# EAGLE design PT4115 Breakout (EAGLE 6.2)
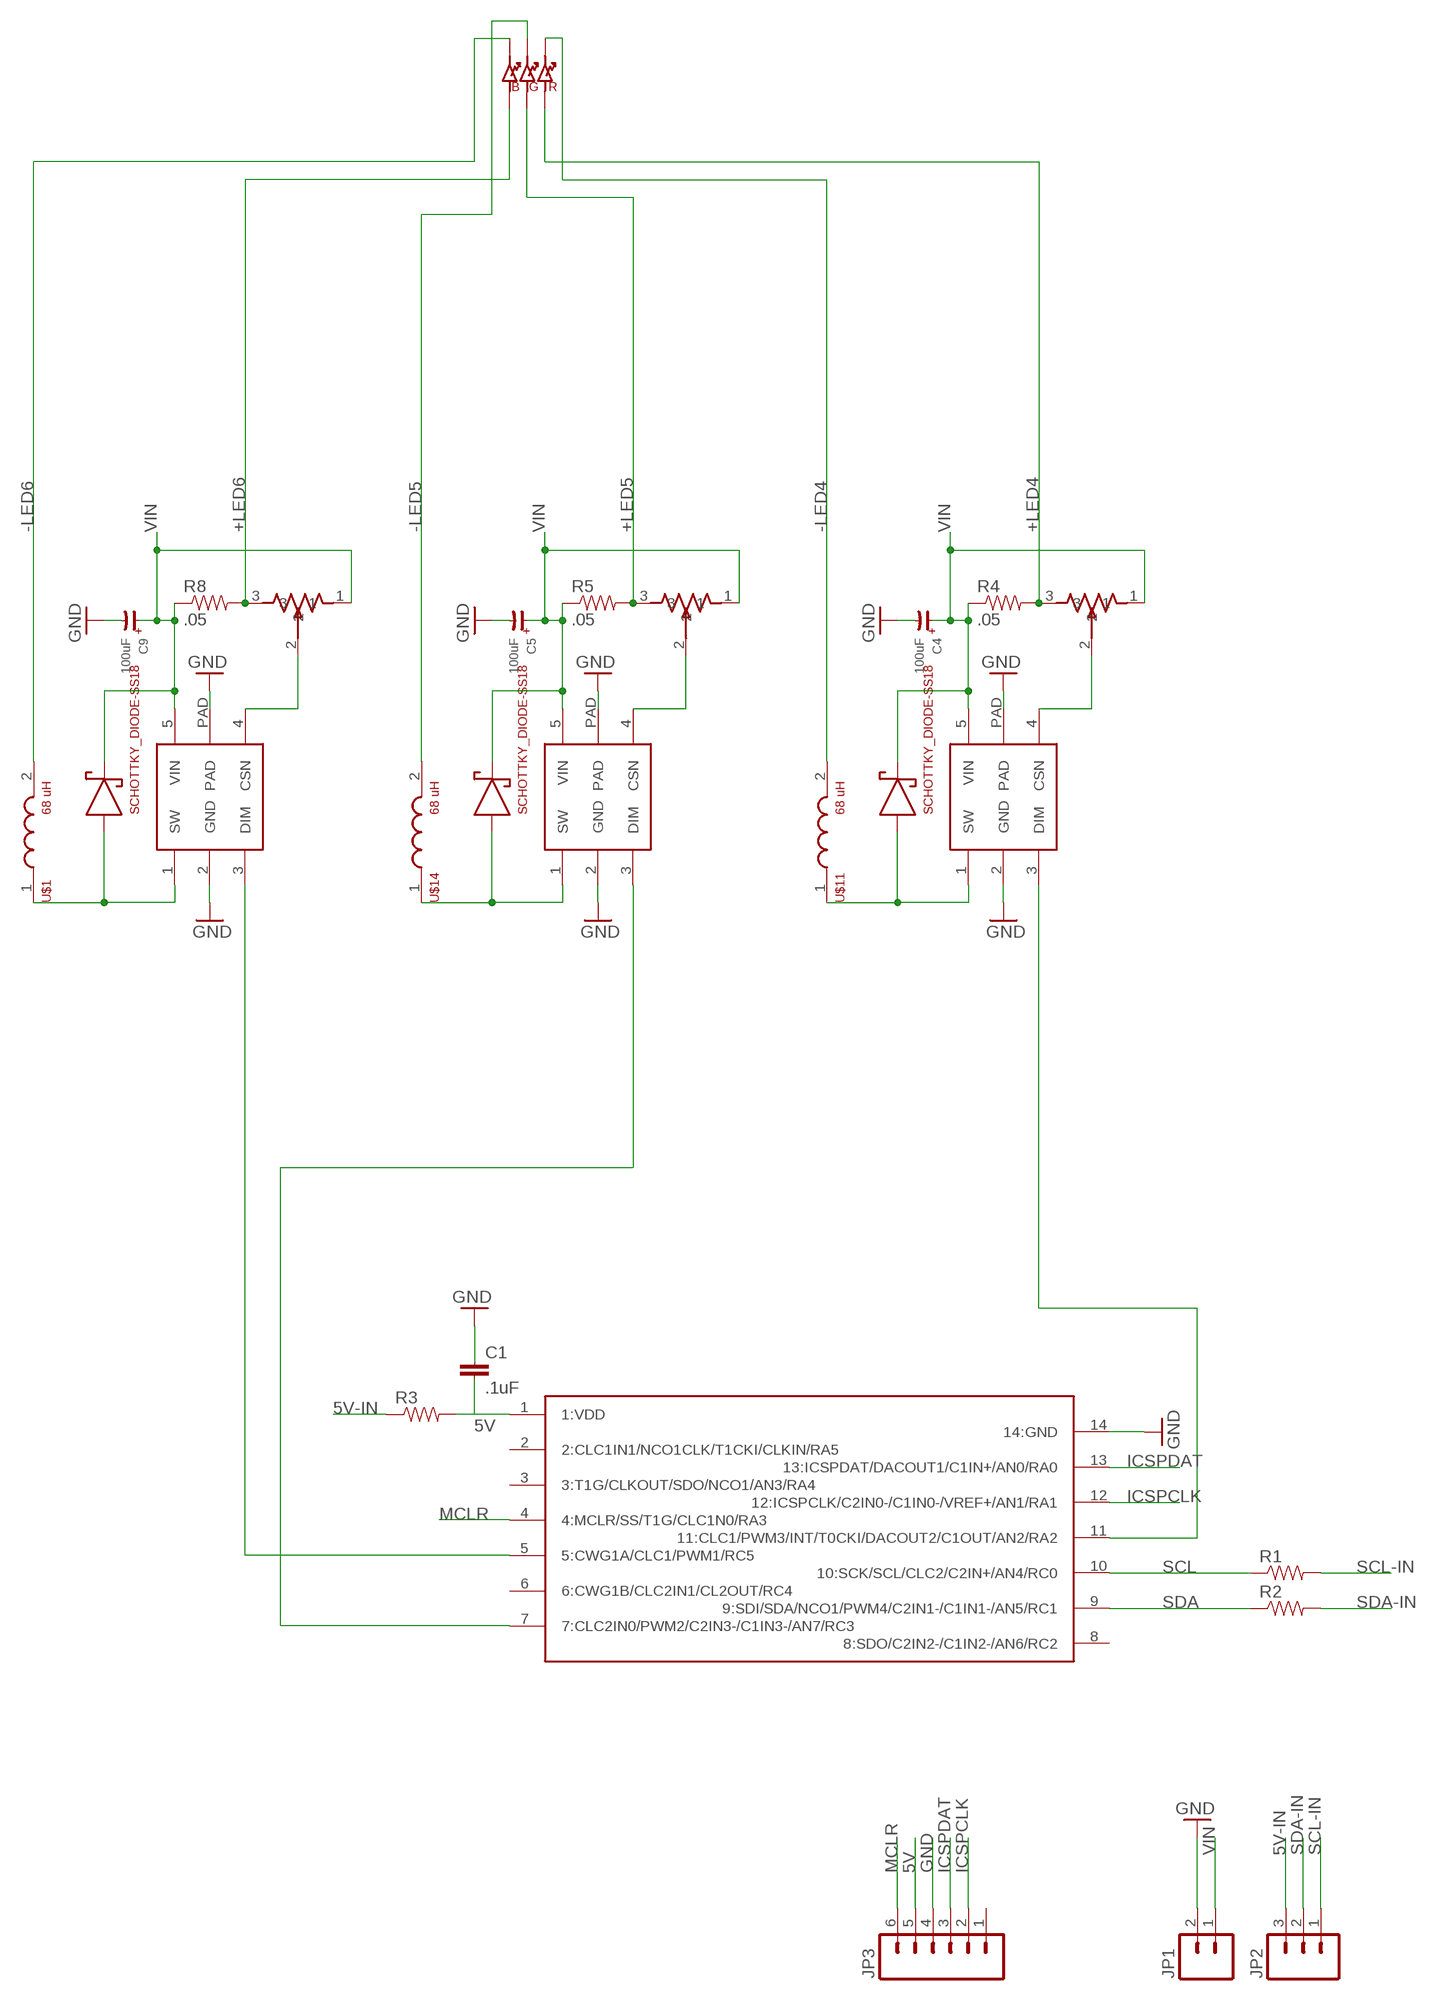
[diagram p0: schematic, sheet 1]

## Parts
C1  .1uF  CAP0805  [0805]
C4  100uF  CAPPOL-8X11  [8MMCAP]
C5  100uF  CAPPOL-8X11  [8MMCAP]
C9  100uF  CAPPOL-8X11  [8MMCAP]
JP1  M02LOCK  [1X02_LOCK]
JP2  M03LOCK  [1X03_LOCK]
JP3  M06LOCK  [1X06_LOCK]
R1  RESISTOR  [0805]
R2  RESISTOR  [0805]
R3  RESISTOR  [0805]
R4  .05  RESISTOR1206  [1206]
R5  .05  RESISTOR1206  [1206]
R8  .05  RESISTOR1206  [1206]
U$1  68 uH  INDUCTORVLF10040  [VLF10040]
U$4  BIGRGB  [BIGRGB]
U$5  PIC16F1503TSSOP14  [TSSOP14]
U$8  TRIMPOTTC33X-2  [TC33X-2]
U$9  TRIMPOTTC33X-2  [TC33X-2]
U$10  TRIMPOTTC33X-2  [TC33X-2]
U$11  68 uH  INDUCTORVLF10040  [VLF10040]
U$12  SCHOTTKY_DIODE-SS18  [DO-214]
U$13  PT4115  [SOT89-5]
U$14  68 uH  INDUCTORVLF10040  [VLF10040]
U$15  SCHOTTKY_DIODE-SS18  [DO-214]
U$16  PT4115  [SOT89-5]
U$23  SCHOTTKY_DIODE-SS18  [DO-214]
U$24  PT4115  [SOT89-5]

## Nets
5V: C1.2 JP3.5 R3.2 U$5.1(1:VDD)
5V-IN: JP2.3 R3.1
+LED4: R4.2 U$4.R+ U$10.3
+LED5: R5.2 U$4.G+ U$9.3
+LED6: R8.2 U$4.B+ U$8.3
-LED4: U$4.R- U$11.2
-LED5: U$4.G- U$14.2
-LED6: U$1.2 U$4.B-
GND: C1.1 C4.- C5.- C9.- JP1.2 JP3.4 U$5.14(14:GND) U$13.2(GND) U$13.PAD U$16.2(GND) U$16.PAD U$24.2(GND) U$24.PAD
ICSPCLK: JP3.2 U$5.12(12:ICSPCLK/C2IN0-/C1IN0-/VREF+/AN1/RA1)
ICSPDAT: JP3.3 U$5.13(13:ICSPDAT/DACOUT1/C1IN+/AN0/RA0)
MCLR: JP3.6 U$5.4(4:MCLR/SS/T1G/CLC1N0/RA3)
N$1: U$5.5(5:CWG1A/CLC1/PWM1/RC5) U$24.3(DIM)
N$2: U$5.7(7:CLC2IN0/PWM2/C2IN3-/C1IN3-/AN7/RC3) U$16.3(DIM)
N$3: U$5.11(11:CLC1/PWM3/INT/T0CKI/DACOUT2/C1OUT/AN2/RA2) U$13.3(DIM)
N$4: U$8.2 U$24.4(CSN)
N$5: U$9.2 U$16.4(CSN)
N$6: U$10.2 U$13.4(CSN)
SCL: R1.1 U$5.10(10:SCK/SCL/CLC2/C2IN+/AN4/RC0)
SCL-IN: JP2.1 R1.2
SDA: R2.1 U$5.9(9:SDI/SDA/NCO1/PWM4/C2IN1-/C1IN1-/AN5/RC1)
SDA-IN: JP2.2 R2.2
SW4: U$11.1 U$12.P$2(ANODE) U$13.1(SW)
SW5: U$14.1 U$15.P$2(ANODE) U$16.1(SW)
SW6: U$1.1 U$23.P$2(ANODE) U$24.1(SW)
VIN: C4.+ C5.+ C9.+ JP1.1 R4.1 R5.1 R8.1 U$8.1 U$9.1 U$10.1 U$12.P$1(CATHODE) U$13.5(VIN) U$15.P$1(CATHODE) U$16.5(VIN) U$23.P$1(CATHODE) U$24.5(VIN)
Unconnected: JP3.1 U$5.2(2:CLC1IN1/NCO1CLK/T1CKI/CLKIN/RA5) U$5.3(3:T1G/CLKOUT/SDO/NCO1/AN3/RA4) U$5.6(6:CWG1B/CLC2IN1/CL2OUT/RC4) U$5.8(8:SDO/C2IN2-/C1IN2-/AN6/RC2)

## Library data of the parts
C1 = 1dah:CAP: Capacitor Standard 0402 ceramic capacitor, and 0.1" leaded capacitor.
C4 C5 C9 = 1dah:CAPPOL
JP1 = 1dah:M02: Header 2 Standard 2-pin 0.1" header. Use with straight break away headers (SKU : PRT-00116), right angle break away headers (PRT-00553), swiss pins (PRT-00743), machine pins (PRT-00117), and female headers (PRT-00115). Molex polarized connector foot print use with SKU : PRT-08233 with associated crimp pins and housings.
JP2 = 1dah:M03: Header 3 Standard 3-pin 0.1" header. Use with straight break away headers (SKU : PRT-00116), right angle break away headers (PRT-00553), swiss pins (PRT-00743), machine pins (PRT-00117), and female headers (PRT-00115). Molex polarized connector foot print use with SKU : PRT-08232 with associated crimp pins and housings.
JP3 = 1dah:M06: Header 6 Standard 6-pin 0.1" header. Use with straight break away headers (SKU : PRT-00116), right angle break away headers (PRT-00553), swiss pins (PRT-00743), machine pins (PRT-00117), and female headers (PRT-00115). Molex polarized connector foot print use with SKU : PRT-08094 with associated crimp pins and housings. NOTES ON THE VARIANTS LOCK and LOCK_LONGPADS... This footprint was designed to help hold the alignment of a through-hole component (i.e. 6-pin header) while soldering it into place. You may notice that each hole has been shifted either up or down by 0.005 of an inch from it's more standard position (which is a perfectly straight line). This slight alteration caused the pins (the squares in the middle) to touch the edges of the holes. Because they are alternating, it causes a "brace" to hold the component in place. 0.005 has proven to be the perfect amount of "off-center" position when using our standard breakaway headers. Although looks a little odd when you look at the bare footprint, once you have a header in there, the alteration is very hard to notice. Also, if you push a header all the way into place, it is covered up entirely on the bottom side. This idea of altering the position of holes to aid alignment will be further integrated into the Sparkfun Library for other footprints. It can help hold any component with 3 or more connection pins.
R1-R5 R8 = 1dah:RESISTOR: Resistor Basic schematic elements and footprints for 0603, 1206, and PTH 1/10th watt (small) resistors.
U$1 U$11 U$14 = 1dah:INDUCTOR
U$4 = 1dah:BIGRGB
U$5 = 1dah:PIC16F1503
U$8-U$10 = 1dah:TRIMPOT: Bournes Trimpot
U$12 U$15 U$23 = 1dah:SCHOTTKY_DIODE: 45V, 1.5A schottky diode
U$13 U$16 U$24 = 1dah:PT4115: Small switching mode constant current PS

## Board
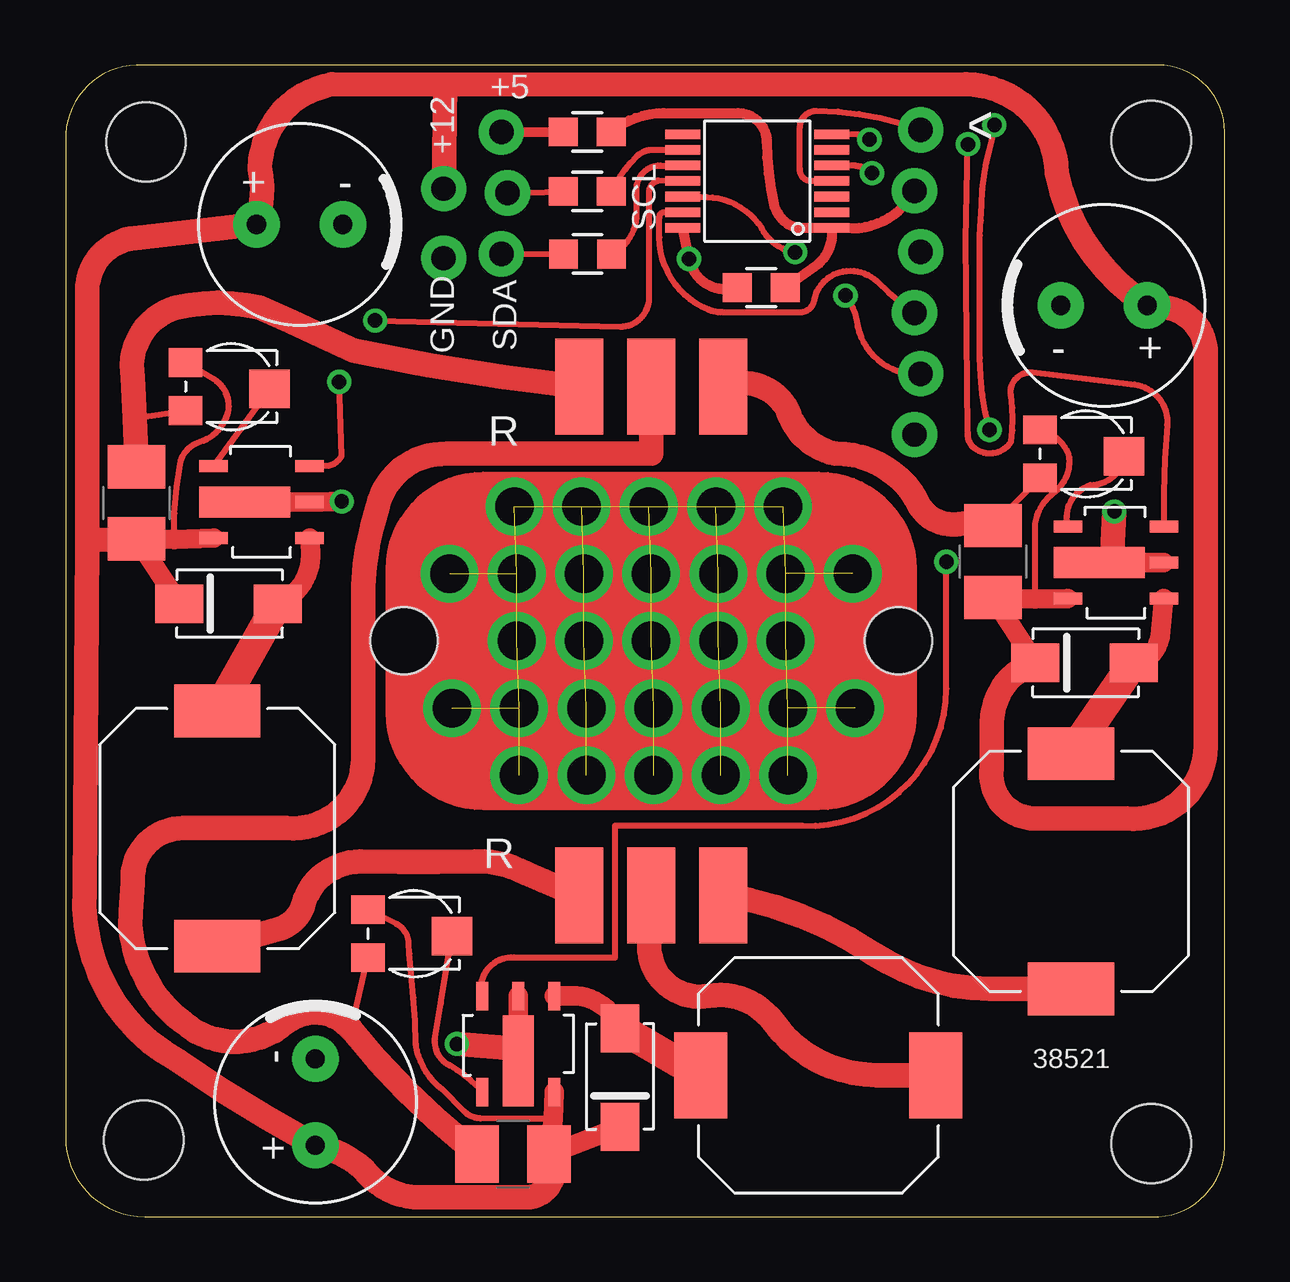
[diagram p1: board, top side]
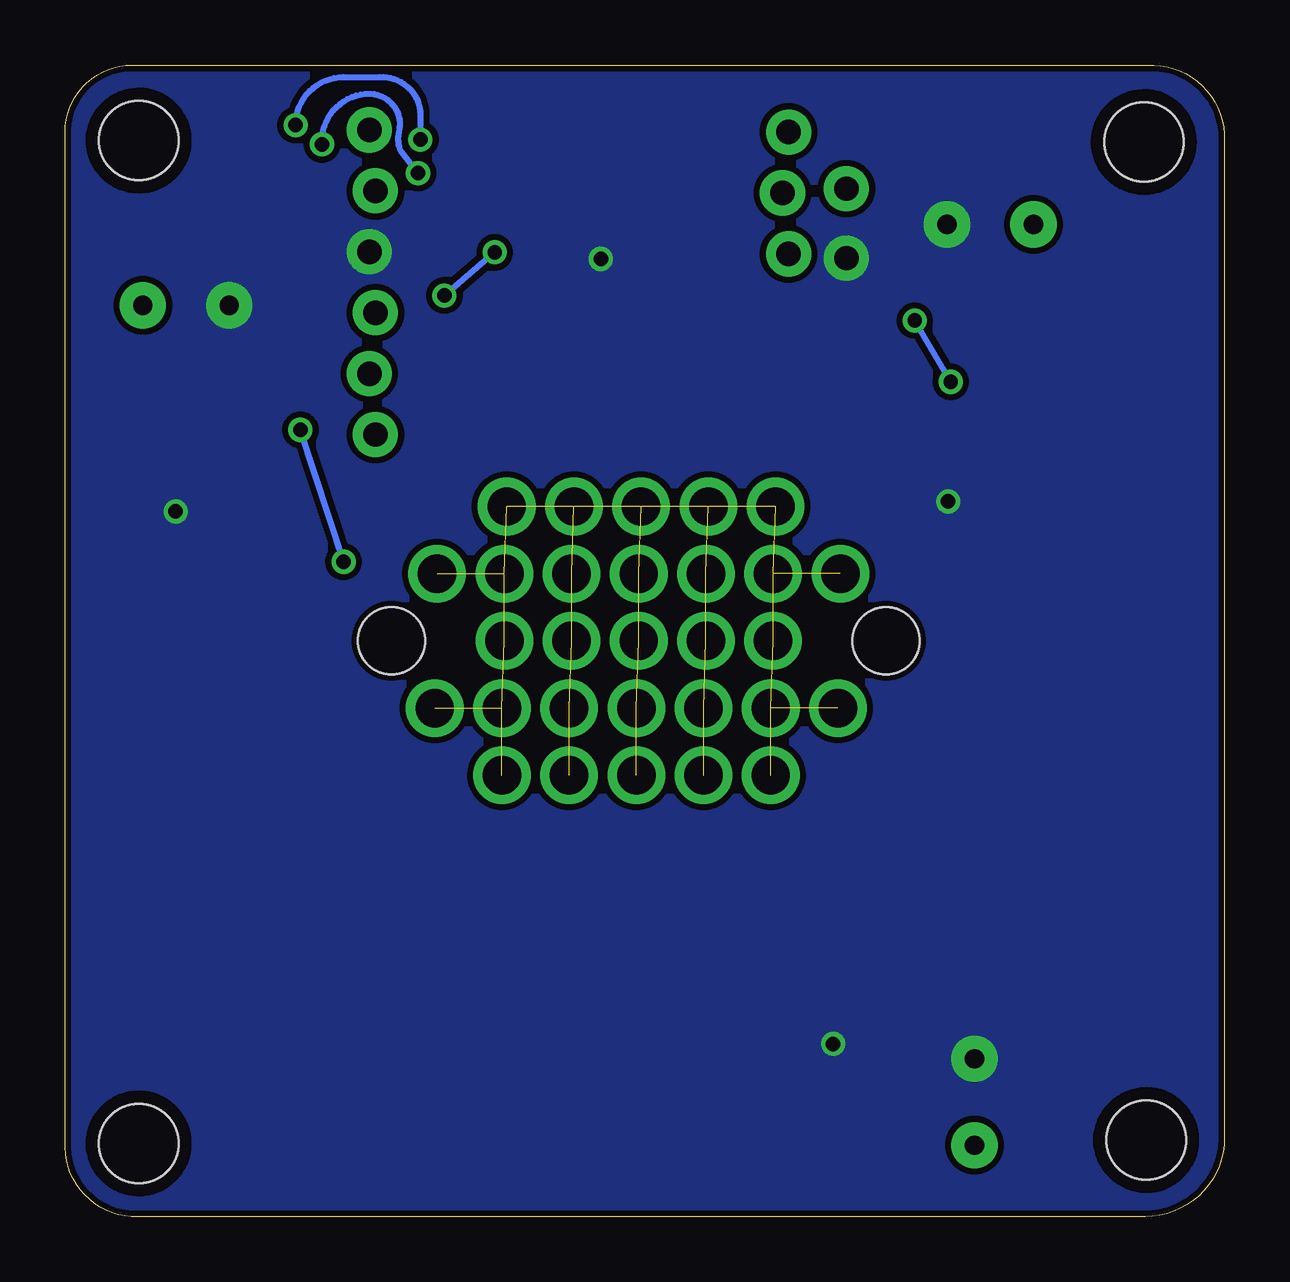
[diagram p2: board, bottom side, seen from below]

Size 48.31 x 48 mm. Coordinates in mm from the lower left corner, seen from the top.
Outline: 48.3,45.22 arc90 45.52,48 2.95,48 arc90 0,44.85 0,3.3 arc90 3.3,0 45.54,0 arc90 48.3,3.16 48.3,45.22
Copper layers (1*16): Top 0.0356mm / dielectric 1.5011mm / Bottom 0.0356mm
Design rules: minimum track width 9mil, minimum drill 18mil, track to track 9mil, track to pad 9mil, pad to pad 9mil, via to via 9mil, smd to smd 9mil, copper to edge 10mil, drill to drill 9mil, minimum pad ring 10mil, minimum via ring 8mil, stop-mask expansion 4mil, vias tented up to drill 25mil, thermal gap 10mil

### Footprints (pad centres in the part's own frame; a part is rotated, then mirrored left to right if it is on the bottom)
0805 = smd 1.2 x 1.2: 1 -1,0; 2 1,0
8MMCAP = drill 0.8 pad 1.93: + 1.8,0; - -1.8,0
1X02_LOCK = drill 1.016 pad 1.88: 1 -0.178,0; 2 2.718,0
1X03_LOCK = drill 1.016 pad 1.88: 1 0,0.127; 2 2.54,-0.127; 3 5.08,0.127
1X06_LOCK = drill 1.016 pad 1.88: 1 0,0.127; 2 2.54,-0.127; 3 5.08,0.127; 4 7.62,-0.127; 5 10.16,0.127; 6 12.7,-0.127
1206 = smd 1.8 x 2.4: 1 -1.5,0; 2 1.5,0
VLF10040 = smd 2.2 x 3.6: 1 -4.9,0; 2 4.9,0
STAND-OFF = hole 3.302: 0,0
BIGRGB = smd 2 x 4: B+ -3,-10.6; B- -3,10.6; G+ 0,-10.6; G- 0,10.6; R+ 3,-10.6; R- 3,10.6 | hole 2.8: -10.3,0; 10.3,0
TSSOP14 = smd 0.4 x 1.45: 1 -1.95,-3.1; 2 -1.3,-3.1; 3 -0.65,-3.1; 4 0,-3.1; 5 0.65,-3.1; 6 1.3,-3.1; 7 1.95,-3.1; 8 1.95,3.1; 9 1.3,3.1; 10 0.65,3.1; 11 0,3.1; 12 -0.65,3.1; 13 -1.3,3.1; 14 -1.95,3.1
TC33X-2 = smd 1.2 x 1.4: 1 -1,-1.9; 3 1,-1.9 | smd 1.6 x 1.7: 2 0.1,1.6
DO-214 = smd 2 x 1.6: P$1 -2.1,0; P$2 2,0
SOT89-5 = smd 0.5 x 1.2: 1 -1.5,-2; 2 0,-2; 3 1.5,-2; 4 1.5,2; 5 -1.5,2 | smd 1.3 x 3.8: PAD 0,0.7

### Placement (x,y rotation side)
C1  28.98,38.73 0 top
C4  9.76,41.37 180 top
C5  10.41,4.78 270 top
C9  43.27,37.99 0 top
JP1  15.75,42.67 270 top
JP2  18.29,40.13 90 top
JP3  35.5,32.6 90 top
R1  21.75,40.13 180 top
R2  21.74,42.73 180 top
R3  21.74,45.22 0 top
R4  2.96,29.75 90 top
R5  18.65,2.61 180 top
R8  38.64,27.31 90 top
U$1  41.89,14.4 270 top
U$2  [STAND-OFF]  3.36,44.8 0 top
U$3  [STAND-OFF]  45.24,44.86 0 top
U$4  24.4,24 180 top
U$5  28.82,43.17 90 top
U$6  [STAND-OFF]  3.26,3.2 0 top
U$7  [STAND-OFF]  45.24,3.06 0 top
U$8  42.5,31.8 270 top
U$9  14.5,11.8 270 top
U$10  6.9,34.6 270 top
U$11  6.32,16.18 270 top
U$12  6.84,25.55 0 top
U$13  8.17,29.79 90 top
U$14  31.36,5.89 0 top
U$15  23.11,5.85 90 top
U$16  18.87,7.2 180 top
U$23  42.51,23.09 0 top
U$24  43.77,27.26 90 top

### Tracks (layer width: path | path; a pad name or v marks a point on that pad's centre or on a via)
5V
  Top 0.406: C1.2 31.22,39.6 arc63 U$5.1 | U$5.1 30.51,41.22 arc-64 29.52,42.2 arc-13 29.22,44.8 arc90 28.02,46 24.92,46 arc39 R3.2 | U$5.1 32.8,41.2 arc61 JP3.5
5V-IN
  Top 0.406: JP2.3 R3.1
+LED4
  Top 0.254: 2.87,33.29 U$10.3
  Top 1.016: U$4.R+ arc-6 12,36.1 arc1 8.1,37.9 arc25 4.6,37.9 arc83 2.8,35 2.87,33.29 R4.2
+LED5
  Top 0.254: 11.9,7.8 U$9.3
  Top 1.016: U$4.G+ 24.4,31.8 15.9,31.8 arc79 13,29.6 arc14 12.4,26.3 12.4,19.1 arc-96 9.2,16.2 4.9,16.2 arc95 2.8,13.9 arc3 2.7,12.1 arc48 4.9,8.1 arc82 9.2,8.1 arc-89 11.9,7.8 arc9 15.4,4.1 R5.2
+LED6
  Top 0.254: R8.2 U$8.3
  Top 1.016: R8.2 arc7 37.4,28.9 arc-71 35.6,29.6 arc66 32.1,31.8 arc-61 30.1,33.6 arc85 U$4.B+
-LED4
  Top 1.016: U$11.2 8.9,12 arc59 9.9,13 arc-75 12.3,14.8 arc1 17.1,14.8 arc-32 19.2,14.3 arc3 U$4.R-
-LED5
  Top 1.016: U$14.2 33.8,5.9 arc-54 29.5,8.1 arc64 26.8,9.2 arc-116 24.4,11.9 arc33 U$4.G-
-LED6
  Top 1.016: U$1.2 38.5,9.5 arc-34 33.6,11 arc25 U$4.B-
GND  (via drill 0.6)
  Top 0.406: U$5.14 v25.98,39.92 arc96 C1.1
  Top 0.813: U$13.PAD U$13.2 arc2 v11.51,29.81 | U$16.PAD 18.87,7 U$16.2 | U$24.PAD 43.6,27.26 U$24.2
  Top 1.016: 43.6,27.26 v43.7,29.4 | v16.3,7.2 18.87,7
  pour Bottom (isolate 0.254, no thermals): -1.81,51.63 51.96,51.63 51.96,-2.5 -1.81,-2.5
ICSPCLK  (via drill 0.6)
  Top 0.254: U$5.12 26.7,42.5 arc-57 29,41.2 arc54 v30.4,40.2 | v32.5,38.4 arc-33 33,37.1 arc81 JP3.2
  Bottom 0.254: v30.4,40.2 v32.5,38.4
ICSPDAT
  Top 0.254: U$5.13 24.95,41.87 arc98 24.74,41.63 24.74,40.81 arc68 26.8,37.8 arc24 27.4,37.7 30.6,37.7 arc80 31.2,38.2 arc-69 32.4,39.4 arc-53 33.8,39 arc11 JP3.3
MCLR
  Top 0.254: U$5.4 31.06,43.17 arc-98 30.6,43.7 30.6,45.4 arc-90 31.3,46.1 arc-20 JP3.6
N$1  (via drill 0.6)
  Top 0.254: U$5.5 32.92,43.8 arc-35 v33.6,43.5 | U$24.3 arc-6 45.9,33 arc92 44.4,34.7 40.3,35.2 arc108 39.4,34.2 arc-16 39.4,32.3 arc-99 37.8,32.1 arc-58 37.6,32.7 37.5,40.7 v37.6,44.7
  Bottom 0.254: v33.6,43.5 34.3,44.4 arc44 34.4,45.2 arc-112 35.8,46.8 arc-88 v37.6,44.7
N$2  (via drill 0.6)
  Top 0.254: U$5.7 33.02,45.1 arc-43 v33.5,44.9 | v36.7,27.3 36.7,22 arc-93 30.7,16.3 22.9,16.3 22.9,10.8 18.8,10.8 arc114 U$16.3 | v38.5,32.8 arc-15 38.1,35.8 38.1,40.9 arc2 38.2,42.8 arc-9 38.5,44.5 arc8 v38.7,45.5
  Bottom 0.254: v36.7,27.3 v38.5,32.8 | v33.5,44.9 33.5,45.9 arc-93 35.2,47.5 36.7,47.5 arc-90 v38.7,45.5
N$3  (via drill 0.6)
  Top 0.254: U$5.11 24.72,43.2 arc77 24.32,42.7 24.32,38.4 arc-95 23.12,37.1 v12.9,37.35 | v11.4,34.8 11.5,31.7 arc-62 10.8,31.3 arc35 U$13.3
  Bottom 0.254: v11.4,34.8 v12.9,37.35
N$4
  Top 0.254: U$24.4 arc-87 42.7,30.5 arc83 U$8.2
N$5
  Top 0.254: U$16.4 arc21 16,6.3 arc-70 15.4,7.5 arc1 U$9.2
N$6
  Top 0.254: U$13.4 U$10.2
SCL
  Top 0.254: U$5.10 24.78,43.82 arc86 23.8,42.9 23.8,41.8 arc-64 R1.1
SCL-IN
  Top 0.254: JP2.1 R1.2
SDA
  Top 0.254: U$5.9 24.45,44.47 arc45 23.8,44.2 arc18 R2.1
SDA-IN
  Top 0.254: JP2.2 R2.2
SINK  (via drill 1.6)  (28 unrouted)
  other vias: 18.7,29.6 21.5,29.6 24.3,29.6 27.1,29.6 29.9,29.6 16,26.8 18.8,26.8 21.6,26.8 24.4,26.8 27.2,26.8 30,26.8 32.8,26.8 18.8,24 21.6,24 24.4,24 27.2,24 30,24 16.1,21.2 18.9,21.2 21.7,21.2 24.5,21.2 27.3,21.2 30.1,21.2 32.9,21.2 18.9,18.4 21.7,18.4 24.5,18.4 27.3,18.4 30.1,18.4
SW4
  Top 0.813: U$13.1 10.21,27.71 arc-73 U$12.P$2
  Top 1.27: U$11.1 U$12.P$2
SW5
  Top 0.813: U$16.1 21.09,9.21 arc-69 U$15.P$2
  Top 1.27: U$15.P$2 U$14.1
SW6
  Top 0.813: U$24.1 45.61,24.21 arc-77 U$23.P$2
  Top 1.27: U$1.1 U$23.P$2
VIN
  Top 0.254: 4.52,28.22 arc-12 4.8,31.5 arc-55 5.6,32.3 arc50 6.7,33.3 arc80 6.2,34.9 U$10.1 | 40.41,25.74 40.4,28.9 arc-43 41.2,30.2 arc65 41.8,31.8 arc51 U$8.1 | 20.31,4.08 arc-2 17.3,4.1 arc-44 16.6,4.4 15.7,5.3 arc-46 14.6,7.2 arc5 14.4,10.1 arc-4 14.3,11.4 arc59 13.8,12.2 U$9.1
  Top 0.813: U$24.5 40.41,25.74 R8.1 U$23.P$1 | U$16.5 20.31,4.08 R5.1 U$15.P$1 | U$13.5 4.52,28.22 R4.1 U$12.P$1
  Top 1.016: U$23.P$1 arc72 38.6,20.6 38.6,18.7 arc99 40.4,16.6 44.2,16.6 arc95 47.5,19.6 47.5,36.1 arc82 45.8,37.9 arc1 C9.+ arc-45 41.3,43.5 arc88 37.5,47.2 15.82,47.19 | R5.1 arc-122 19.2,0.8 arc2 14.8,0.8 arc-54 12.4,2 arc30 C5.+ arc-7 4.7,6.5 arc-65 0.8,13.6 0.9,28.2 | 0.9,28.2 R4.1 | 15.82,47.19 11.1,47.2 arc79 8.1,43.7 arc-29 C4.+ arc1 3.1,40.8 arc90 0.9,38.6 0.9,28.2 | 15.82,47.19 JP1.1

### Text on the board
tPlace: +5 | ^ | +12 | SCL | GND | SDA | 38521